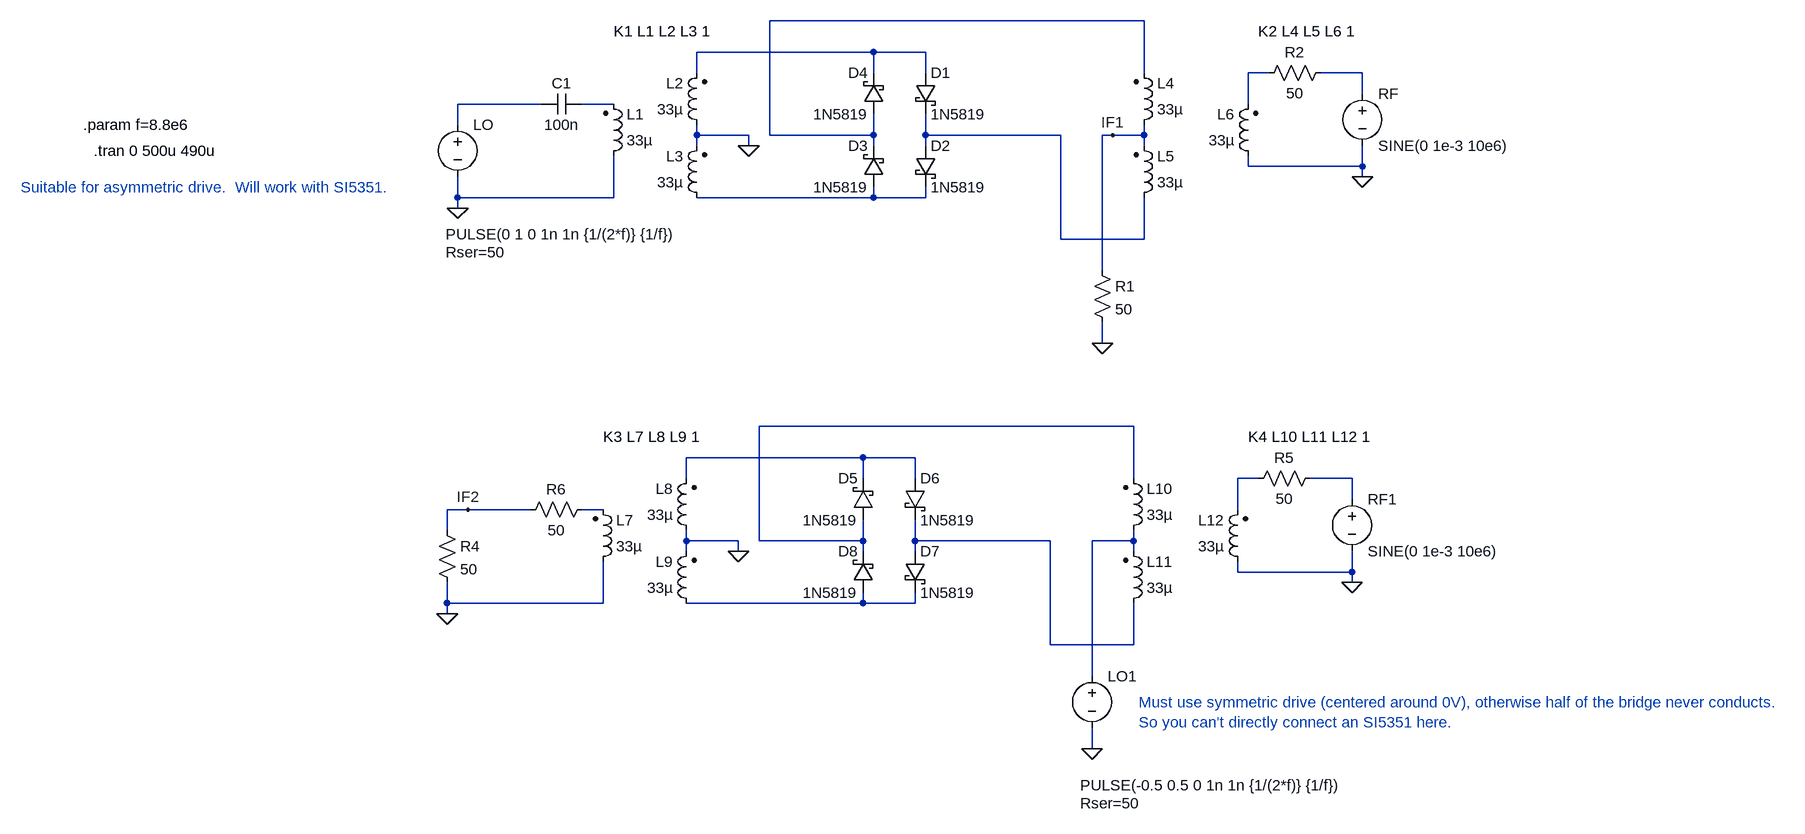
[diagram p0: schematic ring_modulator.asc]
ring_modulator.asc, the LTspice schematic file:
Version 4
SHEET 1 2016 1188
WIRE 944 -32 368 -32
WIRE 528 16 256 16
WIRE 608 16 528 16
WIRE 256 48 256 16
WIRE 528 48 528 16
WIRE 608 48 608 16
WIRE 944 48 944 -32
WIRE 1136 48 1104 48
WIRE 1280 48 1216 48
WIRE 1280 80 1280 48
WIRE 16 96 -112 96
WIRE 128 96 80 96
WIRE 1104 96 1104 48
WIRE -112 128 -112 96
WIRE 256 144 256 128
WIRE 336 144 256 144
WIRE 368 144 368 -32
WIRE 528 144 528 112
WIRE 528 144 368 144
WIRE 608 144 608 112
WIRE 816 144 608 144
WIRE 896 144 880 144
WIRE 944 144 944 128
WIRE 944 144 896 144
WIRE 256 160 256 144
WIRE 336 160 336 144
WIRE 528 160 528 144
WIRE 608 160 608 144
WIRE 944 160 944 144
WIRE 1104 192 1104 176
WIRE 1280 192 1280 160
WIRE 1280 192 1104 192
WIRE 1280 208 1280 192
WIRE -112 240 -112 208
WIRE 128 240 128 176
WIRE 128 240 -112 240
WIRE 528 240 528 224
WIRE 528 240 256 240
WIRE 608 240 608 224
WIRE 608 240 528 240
WIRE -112 256 -112 240
WIRE 816 304 816 144
WIRE 944 304 944 240
WIRE 944 304 816 304
WIRE 880 352 880 144
WIRE 880 464 880 432
WIRE 928 592 352 592
WIRE 512 640 240 640
WIRE 592 640 512 640
WIRE 240 672 240 640
WIRE 512 672 512 640
WIRE 592 672 592 640
WIRE 928 672 928 592
WIRE 1120 672 1088 672
WIRE 1264 672 1200 672
WIRE 1264 704 1264 672
WIRE -96 720 -128 720
WIRE 0 720 -96 720
WIRE 112 720 80 720
WIRE 1088 720 1088 672
WIRE -128 752 -128 720
WIRE 240 768 240 752
WIRE 320 768 240 768
WIRE 352 768 352 592
WIRE 512 768 512 736
WIRE 512 768 352 768
WIRE 592 768 592 736
WIRE 800 768 592 768
WIRE 928 768 928 752
WIRE 928 768 864 768
WIRE 240 784 240 768
WIRE 320 784 320 768
WIRE 512 784 512 768
WIRE 592 784 592 768
WIRE 928 784 928 768
WIRE 1088 816 1088 800
WIRE 1264 816 1264 784
WIRE 1264 816 1088 816
WIRE 1264 832 1264 816
WIRE -128 864 -128 832
WIRE 112 864 112 800
WIRE 112 864 -128 864
WIRE 512 864 512 848
WIRE 512 864 240 864
WIRE 592 864 592 848
WIRE 592 864 512 864
WIRE -128 880 -128 864
WIRE 800 928 800 768
WIRE 928 928 928 864
WIRE 928 928 800 928
WIRE 864 976 864 768
WIRE 864 1088 864 1056
FLAG 336 160 0
FLAG -112 256 0
FLAG 1280 208 0
FLAG 880 464 0
FLAG 896 144 IF1
FLAG 320 784 0
FLAG -128 880 0
FLAG 1264 832 0
FLAG 864 1088 0
FLAG -96 720 IF2
SYMBOL voltage -112 112 R0
WINDOW 3 -18 184 Left 2
WINDOW 123 0 0 Left 0
WINDOW 39 -18 212 Left 2
SYMATTR Value PULSE(0 1 0 1n 1n {1/(2*f)} {1/f})
SYMATTR SpiceLine Rser=50
SYMATTR InstName LO
SYMBOL ind2 112 192 M180
WINDOW 0 36 80 Left 2
WINDOW 3 36 40 Left 2
SYMATTR InstName L1
SYMATTR Value 33µ
SYMATTR Type ind
SYMBOL ind2 272 144 R180
WINDOW 0 36 80 Left 2
WINDOW 3 36 40 Left 2
SYMATTR InstName L2
SYMATTR Value 33µ
SYMATTR Type ind
SYMBOL ind2 272 256 R180
WINDOW 0 36 80 Left 2
WINDOW 3 36 40 Left 2
SYMATTR InstName L3
SYMATTR Value 33µ
SYMATTR Type ind
SYMBOL ind2 928 144 M180
WINDOW 0 36 80 Left 2
WINDOW 3 36 40 Left 2
SYMATTR InstName L4
SYMATTR Value 33µ
SYMATTR Type ind
SYMBOL ind2 928 256 M180
WINDOW 0 36 80 Left 2
WINDOW 3 36 40 Left 2
SYMATTR InstName L5
SYMATTR Value 33µ
SYMATTR Type ind
SYMBOL ind2 1120 192 R180
WINDOW 0 36 80 Left 2
WINDOW 3 36 40 Left 2
SYMATTR InstName L6
SYMATTR Value 33µ
SYMATTR Type ind
SYMBOL schottky 544 112 R180
WINDOW 0 24 64 Left 2
WINDOW 3 24 0 Left 2
SYMATTR InstName D4
SYMATTR Value 1N5819
SYMATTR Description Diode
SYMATTR Type diode
SYMBOL voltage 1280 64 R0
WINDOW 123 0 0 Left 0
WINDOW 39 24 124 Left 2
SYMATTR InstName RF
SYMATTR Value SINE(0 1e-3 10e6)
SYMBOL res 864 336 R0
SYMATTR InstName R1
SYMATTR Value 50
SYMBOL schottky 592 48 R0
SYMATTR InstName D1
SYMATTR Value 1N5819
SYMATTR Description Diode
SYMATTR Type diode
SYMBOL schottky 592 160 R0
SYMATTR InstName D2
SYMATTR Value 1N5819
SYMATTR Description Diode
SYMATTR Type diode
SYMBOL schottky 544 224 R180
WINDOW 0 24 64 Left 2
WINDOW 3 24 0 Left 2
SYMATTR InstName D3
SYMATTR Value 1N5819
SYMATTR Description Diode
SYMATTR Type diode
SYMBOL res 1232 32 R90
WINDOW 0 0 56 VBottom 2
WINDOW 3 32 56 VTop 2
SYMATTR InstName R2
SYMATTR Value 50
SYMBOL voltage 864 960 R0
WINDOW 3 -18 184 Left 2
WINDOW 123 0 0 Left 0
WINDOW 39 -18 212 Left 2
SYMATTR Value PULSE(-0.5 0.5 0 1n 1n {1/(2*f)} {1/f})
SYMATTR SpiceLine Rser=50
SYMATTR InstName LO1
SYMBOL ind2 96 816 M180
WINDOW 0 36 80 Left 2
WINDOW 3 36 40 Left 2
SYMATTR InstName L7
SYMATTR Value 33µ
SYMATTR Type ind
SYMBOL ind2 256 768 R180
WINDOW 0 36 80 Left 2
WINDOW 3 36 40 Left 2
SYMATTR InstName L8
SYMATTR Value 33µ
SYMATTR Type ind
SYMBOL ind2 256 880 R180
WINDOW 0 36 80 Left 2
WINDOW 3 36 40 Left 2
SYMATTR InstName L9
SYMATTR Value 33µ
SYMATTR Type ind
SYMBOL ind2 912 768 M180
WINDOW 0 36 80 Left 2
WINDOW 3 36 40 Left 2
SYMATTR InstName L10
SYMATTR Value 33µ
SYMATTR Type ind
SYMBOL ind2 912 880 M180
WINDOW 0 36 80 Left 2
WINDOW 3 36 40 Left 2
SYMATTR InstName L11
SYMATTR Value 33µ
SYMATTR Type ind
SYMBOL ind2 1104 816 R180
WINDOW 0 36 80 Left 2
WINDOW 3 36 40 Left 2
SYMATTR InstName L12
SYMATTR Value 33µ
SYMATTR Type ind
SYMBOL schottky 528 736 R180
WINDOW 0 24 64 Left 2
WINDOW 3 24 0 Left 2
SYMATTR InstName D5
SYMATTR Value 1N5819
SYMATTR Description Diode
SYMATTR Type diode
SYMBOL voltage 1264 688 R0
WINDOW 123 0 0 Left 0
WINDOW 39 24 124 Left 2
SYMATTR InstName RF1
SYMATTR Value SINE(0 1e-3 10e6)
SYMBOL res -144 736 R0
SYMATTR InstName R4
SYMATTR Value 50
SYMBOL schottky 576 672 R0
SYMATTR InstName D6
SYMATTR Value 1N5819
SYMATTR Description Diode
SYMATTR Type diode
SYMBOL schottky 576 784 R0
SYMATTR InstName D7
SYMATTR Value 1N5819
SYMATTR Description Diode
SYMATTR Type diode
SYMBOL schottky 528 848 R180
WINDOW 0 24 64 Left 2
WINDOW 3 24 0 Left 2
SYMATTR InstName D8
SYMATTR Value 1N5819
SYMATTR Description Diode
SYMATTR Type diode
SYMBOL res 1216 656 R90
WINDOW 0 0 56 VBottom 2
WINDOW 3 32 56 VTop 2
SYMATTR InstName R5
SYMATTR Value 50
SYMBOL res 96 704 R90
WINDOW 0 0 56 VBottom 2
WINDOW 3 32 56 VTop 2
SYMATTR InstName R6
SYMATTR Value 50
SYMBOL cap 80 80 R90
WINDOW 0 0 32 VBottom 2
WINDOW 3 32 32 VTop 2
SYMATTR InstName C1
SYMATTR Value 100n
TEXT 128 -16 Left 2 !K1 L1 L2 L3 1
TEXT 1120 -16 Left 2 !K2 L4 L5 L6 1
TEXT -688 128 Left 2 !.param f=8.8e6
TEXT -672 168 Left 2 !.tran 0 500u 490u
TEXT 112 608 Left 2 !K3 L7 L8 L9 1
TEXT 1104 608 Left 2 !K4 L10 L11 L12 1
TEXT 936 1016 Left 2 ;Must use symmetric drive (centered around 0V), otherwise half of the bridge never conducts.\nSo you can't directly connect an SI5351 here.
TEXT -784 224 Left 2 ;Suitable for asymmetric drive.  Will work with SI5351.

The netlist it stands for:
* ring_modulator.asc
V§LO N005 0 PULSE(0 1 0 1n 1n {1/(2*f)} {1/f}) Rser=50
L1 0 N006 33µ
L2 0 N002 33µ
L3 N008 0 33µ
L4 IF1 N001 33µ
L5 N007 IF1 33µ
L6 0 N003 33µ
D4 N001 N002 1N5819
V§RF N004 0 SINE(0 1e-3 10e6)
R1 IF1 0 50
D1 N002 N007 1N5819
D2 N007 N008 1N5819
D3 N008 N001 1N5819
R2 N004 N003 50
V§LO1 N015 0 PULSE(-0.5 0.5 0 1n 1n {1/(2*f)} {1/f}) Rser=50
L7 0 N013 33µ
L8 0 N010 33µ
L9 N016 0 33µ
L10 N015 N009 33µ
L11 N014 N015 33µ
L12 0 N011 33µ
D5 N009 N010 1N5819
V§RF1 N012 0 SINE(0 1e-3 10e6)
R4 IF2 0 50
D6 N010 N014 1N5819
D7 N014 N016 1N5819
D8 N016 N009 1N5819
R5 N012 N011 50
R6 N013 IF2 50
C1 N006 N005 100n
.model D D
.lib standard.dio
K1 L1 L2 L3 1
K2 L4 L5 L6 1
.param f=8.8e6
.tran 0 500u 490u
K3 L7 L8 L9 1
K4 L10 L11 L12 1
* Must use symmetric drive (centered around 0V), otherwise half of the bridge never conducts.
* So you can't directly connect an SI5351 here.
* Suitable for asymmetric drive.  Will work with SI5351.
.backanno
.end